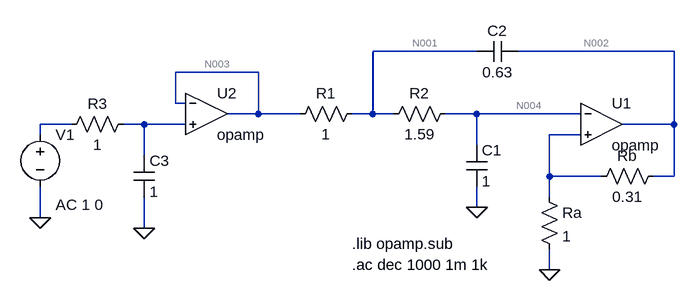
[diagram p0: schematic circuito1.asc]
circuito1.asc, the LTspice schematic file:
Version 4.1
SHEET 1 880 680
WIRE 400 16 240 16
WIRE 704 16 464 16
WIRE 64 48 -64 48
WIRE -64 96 -64 48
WIRE -48 96 -64 96
WIRE 64 112 64 48
WIRE 64 112 16 112
WIRE 128 112 64 112
WIRE 240 112 240 16
WIRE 240 112 208 112
WIRE 272 112 240 112
WIRE 400 112 352 112
WIRE 560 112 400 112
WIRE -224 128 -272 128
WIRE -112 128 -144 128
WIRE -48 128 -112 128
WIRE 704 128 704 16
WIRE 704 128 624 128
WIRE -272 144 -272 128
WIRE 560 144 512 144
WIRE 400 160 400 112
WIRE -112 176 -112 128
WIRE 512 208 512 144
WIRE 592 208 512 208
WIRE 704 208 704 128
WIRE 704 208 672 208
WIRE 512 240 512 208
WIRE 400 256 400 224
WIRE -272 272 -272 224
WIRE -112 288 -112 240
WIRE 512 352 512 320
FLAG 400 256 0
FLAG 512 352 0
FLAG -112 288 0
FLAG -272 272 0
SYMBOL res 224 96 R90
WINDOW 0 0 56 VBottom 2
WINDOW 3 32 56 VTop 2
SYMATTR InstName R1
SYMATTR Value 1
SYMBOL res 368 96 R90
WINDOW 0 0 56 VBottom 2
WINDOW 3 32 56 VTop 2
SYMATTR InstName R2
SYMATTR Value 1.59
SYMBOL cap 384 160 R0
SYMATTR InstName C1
SYMATTR Value 1
SYMBOL cap 464 0 R90
WINDOW 0 0 32 VBottom 2
WINDOW 3 32 32 VTop 2
SYMATTR InstName C2
SYMATTR Value 0.63
SYMBOL OpAmps\\opamp 592 64 R0
SYMATTR InstName U1
SYMBOL res 496 224 R0
SYMATTR InstName Ra
SYMATTR Value 1
SYMBOL res 688 192 R90
WINDOW 0 0 56 VBottom 2
WINDOW 3 32 56 VTop 2
SYMATTR InstName Rb
SYMATTR Value 0.31
SYMBOL res -128 112 R90
WINDOW 0 0 56 VBottom 2
WINDOW 3 32 56 VTop 2
SYMATTR InstName R3
SYMATTR Value 1
SYMBOL cap -128 176 R0
SYMATTR InstName C3
SYMATTR Value 1
SYMBOL OpAmps\\opamp -16 48 R0
SYMATTR InstName U2
SYMBOL voltage -272 128 R0
WINDOW 123 24 124 Left 2
WINDOW 39 0 0 Left 0
SYMATTR InstName V1
SYMATTR Value ""
SYMATTR Value2 AC 1 0
TEXT 208 312 Left 2 !.lib opamp.sub
TEXT 208 344 Left 2 !.ac dec 1000 1m 1k

The netlist it stands for:
* circuito1.asc
R1 N001 N003 1
R2 N004 N001 1.59
C1 N004 0 1
C2 N002 N001 0.63
X§U1 N004 N007 N002 opamp Aol=100K GBW=10Meg  ; pins invin noninvin out
Ra N007 0 1
Rb N002 N007 0.31
R3 N006 N005 1
C3 N006 0 1
X§U2 N003 N006 N003 opamp Aol=100K GBW=10Meg  ; pins invin noninvin out
V1 N005 0 AC 1 0
.lib opamp.sub
.ac dec 1000 1m 1k
.backanno
.end

* Results of the author's LTspice run, read from the files saved beside the schematic
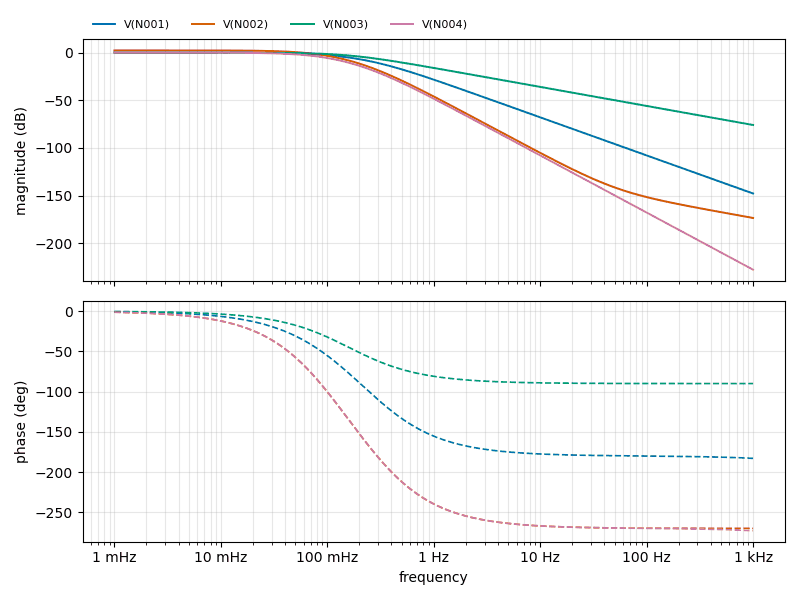
[diagram p1: AC Analysis of circuito1.asc, plotted from the saved traces]
* AC Analysis, 1 run:
*   V(N001): -0.00 dB at 1 mHz, -147.90 dB at 1 kHz, peak -0.00 dB at 1 mHz, 3 dB below the peak at 109.2 mHz
*   V(N002): 2.34 dB at 1 mHz, -173.60 dB at 1 kHz, peak 2.34 dB at 1 mHz, 3 dB below the peak at 67.22 mHz
*   V(N003): -0.00 dB at 1 mHz, -75.96 dB at 1 kHz, peak -0.00 dB at 1 mHz, 3 dB below the peak at 159.2 mHz
*   V(N004): -0.00 dB at 1 mHz, -227.89 dB at 1 kHz, peak -0.00 dB at 1 mHz, 3 dB below the peak at 67.22 mHz